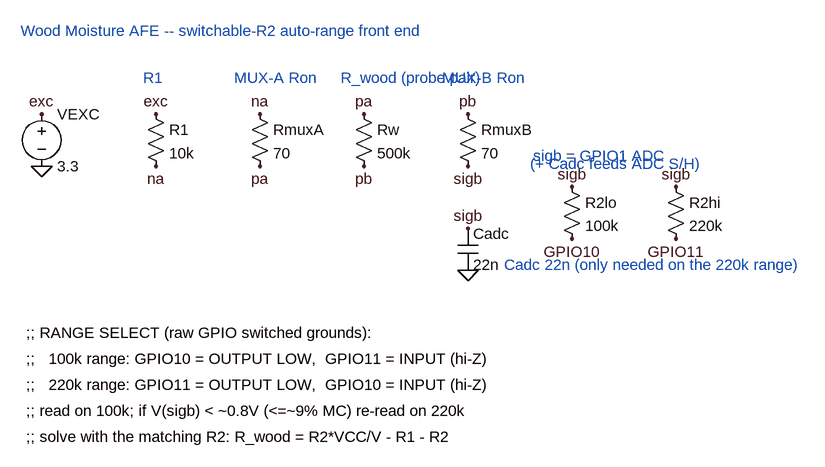
[diagram p0: schematic wood_afe_autorange_sch.asc]
wood_afe_autorange_sch.asc, the LTspice schematic file:
Version 4
SHEET 1 1600 1000
FLAG 144 224 exc
FLAG 144 304 0
FLAG 320 224 exc
FLAG 320 304 na
FLAG 480 224 na
FLAG 480 304 pa
FLAG 640 224 pa
FLAG 640 304 pb
FLAG 800 224 pb
FLAG 800 304 sigb
FLAG 960 336 sigb
FLAG 960 416 GPIO10
FLAG 1120 336 sigb
FLAG 1120 416 GPIO11
FLAG 800 400 sigb
FLAG 800 464 0
SYMBOL voltage 144 208 R0
SYMATTR InstName VEXC
SYMATTR Value 3.3
SYMBOL res 304 208 R0
SYMATTR InstName R1
SYMATTR Value 10k
SYMBOL res 464 208 R0
SYMATTR InstName RmuxA
SYMATTR Value 70
SYMBOL res 624 208 R0
SYMATTR InstName Rw
SYMATTR Value 500k
SYMBOL res 784 208 R0
SYMATTR InstName RmuxB
SYMATTR Value 70
SYMBOL res 944 320 R0
SYMATTR InstName R2lo
SYMATTR Value 100k
SYMBOL res 1104 320 R0
SYMATTR InstName R2hi
SYMATTR Value 220k
SYMBOL cap 784 400 R0
SYMATTR InstName Cadc
SYMATTR Value 22n
TEXT 112 96 Left 2 ;Wood Moisture AFE -- switchable-R2 auto-range front end
TEXT 300 168 Left 2 ;R1
TEXT 440 168 Left 2 ;MUX-A Ron
TEXT 604 168 Left 2 ;R_wood (probe pair)
TEXT 760 168 Left 2 ;MUX-B Ron
TEXT 900 288 Left 2 ;sigb = GPIO1 ADC
TEXT 896 300 Left 2 ;(+ Cadc feeds ADC S/H)
TEXT 856 456 Left 2 ;Cadc 22n (only needed on the 220k range)
TEXT 120 560 Left 2 !;; RANGE SELECT (raw GPIO switched grounds):
TEXT 120 600 Left 2 !;;   100k range: GPIO10 = OUTPUT LOW,  GPIO11 = INPUT (hi-Z)
TEXT 120 640 Left 2 !;;   220k range: GPIO11 = OUTPUT LOW,  GPIO10 = INPUT (hi-Z)
TEXT 120 680 Left 2 !;; read on 100k; if V(sigb) < ~0.8V (<=~9% MC) re-read on 220k
TEXT 120 720 Left 2 !;; solve with the matching R2: R_wood = R2*VCC/V - R1 - R2

The netlist it stands for:
* wood_afe_autorange_sch.asc
VEXC exc 0 3.3
R1 exc na 10k
RmuxA na pa 70
Rw pa pb 500k
RmuxB pb sigb 70
R2lo sigb GPIO10 100k
R2hi sigb GPIO11 220k
Cadc sigb 0 22n
* Wood Moisture AFE -- switchable-R2 auto-range front end
* R1
* MUX-A Ron
* R_wood (probe pair)
* MUX-B Ron
* sigb = GPIO1 ADC
* (+ Cadc feeds ADC S/H)
* Cadc 22n (only needed on the 220k range)
;; RANGE SELECT (raw GPIO switched grounds):
;;   100k range: GPIO10 = OUTPUT LOW,  GPIO11 = INPUT (hi-Z)
;;   220k range: GPIO11 = OUTPUT LOW,  GPIO10 = INPUT (hi-Z)
;; read on 100k; if V(sigb) < ~0.8V (<=~9% MC) re-read on 220k
;; solve with the matching R2: R_wood = R2*VCC/V - R1 - R2
.backanno
.end